# Altium schematic sheet 1210B475K101NT1_1210B475K101NT.schdoc
size 127 x 101 mm
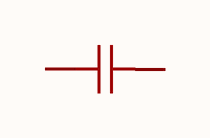
[diagram p0: 1210B475K101NT1_1210B475K101NT.schdoc]

## Parts
C?  4.7uF  [c1210]  (value not drawn)

## Nets

Not connected (* = marked no-connect by the designer): C? 1 2

## Library data of the parts
C? = 1210B475K101NT: Manufacturer: FH(风华); Add into BOM: yes; Tolerance: ±10%; Voltage Rated: 100V; Temperature Coefficient: X7R; Symbol: 1210B475K101NT; Device: 1210B475K101NT; LCSC Part Name: 4.7uF ±10% 100V; Supplier Part: C2840282; Manufacturer Part: 1210B475K101NT; Supplier Footprint: 1210; JLCPCB Part Class: Extended Part; Datasheet: https://atta.szlcsc.com/upload/public/pdf/source/20210617/C2840282_5B7AB5BFD77495008CFAB3FC2796A0E9.pdf; Supplier: LCSC; Convert to PCB: yes; Value: 4.7uF